# EAGLE schematic schematic (EAGLE 8.3.1)
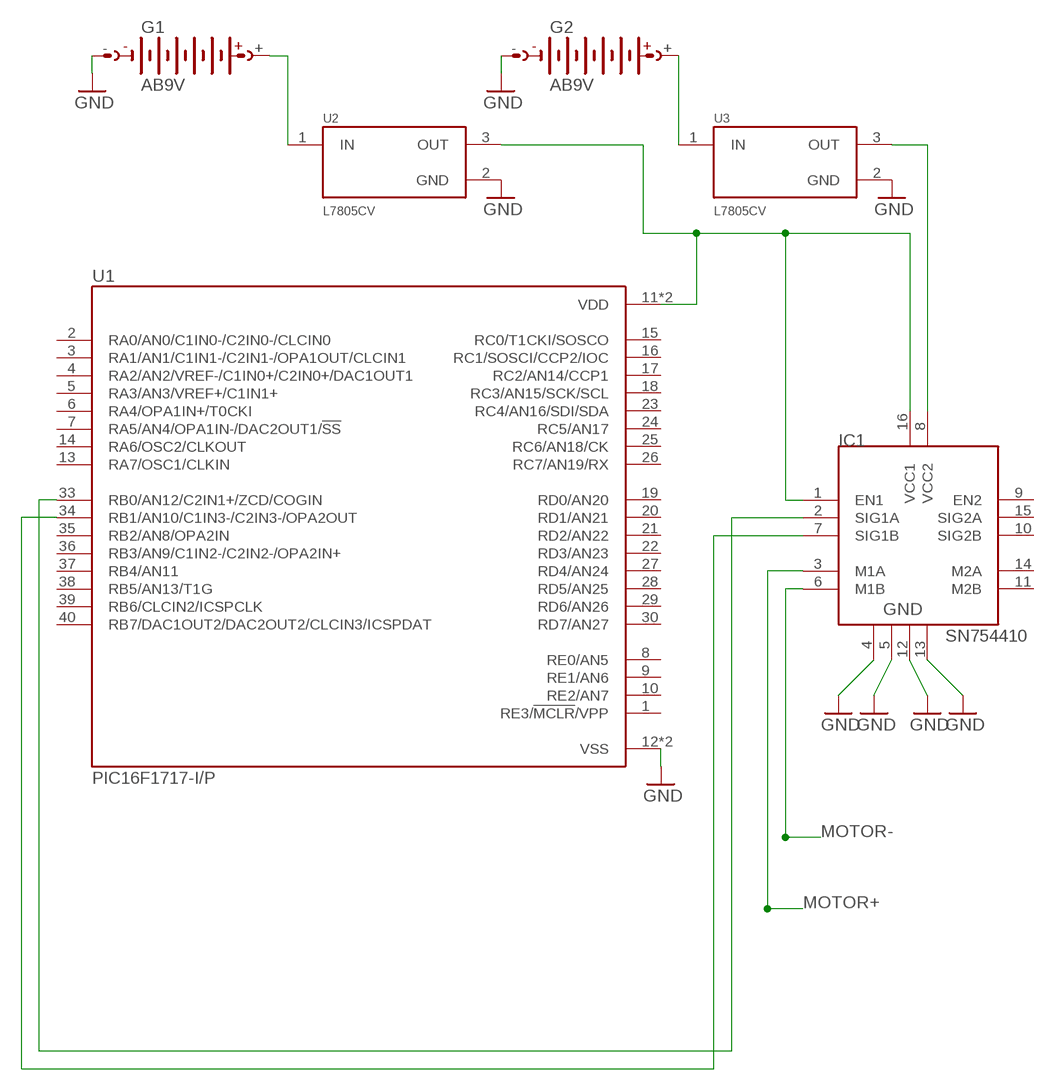
[diagram p0: schematic, sheet 1]

## Parts
G1  AB9V  [AB9V]
G2  AB9V  [AB9V]
IC1  SN754410  [DIP16]
U1  PIC16F1717-I/P  [DIP1543W47P254L5321H635Q40]
U2  L7805CV  [TO254P460X1020X1945-3P]
U3  L7805CV  [TO254P460X1020X1945-3P]

## Nets
GND: G1.- G2.- IC1.4 IC1.5 IC1.12 IC1.13 U1.12(VSS) U1.31(VSS) U2.2(GND) U3.2(GND)
MOTOR+: IC1.3(M1A)
MOTOR-: IC1.6(M1B)
N$1: IC1.2(SIG1A) U1.33(RB0/AN12/C2IN1+/ZCD/COGIN)
N$2: IC1.7(SIG1B) U1.34(RB1/AN10/C1IN3-/C2IN3-/OPA2OUT)
N$3: G1.+ U2.1(IN)
N$4: G2.+ U3.1(IN)
N$5: IC1.8(VCC2) U3.3(OUT)
N$6: IC1.1(EN1) IC1.16(VCC1) U1.11(VDD) U1.32(VDD) U2.3(OUT)
Unconnected: IC1.9(EN2) IC1.10(SIG2B) IC1.11(M2B) IC1.14(M2A) IC1.15(SIG2A) U1.1(RE3/!MCLR!/VPP) U1.2(RA0/AN0/C1IN0-/C2IN0-/CLCIN0) U1.3(RA1/AN1/C1IN1-/C2IN1-/OPA1OUT/CLCIN1) U1.4(RA2/AN2/VREF-/C1IN0+/C2IN0+/DAC1OUT1) U1.5(RA3/AN3/VREF+/C1IN1+) U1.6(RA4/OPA1IN+/T0CKI) U1.7(RA5/AN4/OPA1IN-/DAC2OUT1/!SS) U1.8(RE0/AN5) U1.9(RE1/AN6) U1.10(RE2/AN7) U1.13(RA7/OSC1/CLKIN) U1.14(RA6/OSC2/CLKOUT) U1.15(RC0/T1CKI/SOSCO) U1.16(RC1/SOSCI/CCP2/IOC) U1.17(RC2/AN14/CCP1) U1.18(RC3/AN15/SCK/SCL) U1.19(RD0/AN20) U1.20(RD1/AN21) U1.21(RD2/AN22) U1.22(RD3/AN23) U1.23(RC4/AN16/SDI/SDA) U1.24(RC5/AN17) U1.25(RC6/AN18/CK) U1.26(RC7/AN19/RX) U1.27(RD4/AN24) U1.28(RD5/AN25) U1.29(RD6/AN26) U1.30(RD7/AN27) U1.35(RB2/AN8/OPA2IN) U1.36(RB3/AN9/C1IN2-/C2IN2-/OPA2IN+) U1.37(RB4/AN11) U1.38(RB5/AN13/T1G) U1.39(RB6/CLCIN2/ICSPCLK) U1.40(RB7/DAC1OUT2/DAC2OUT2/CLCIN3/ICSPDAT)

## Library data of the parts
G1 G2 = battery:AB9V: 9-V BATTERY CLIP
IC1 = HBridge:SN754410: Quadruple half-H driver
U1 = PIC16F1717-I_P:PIC16F1717-I/P: MCU 8-bit PIC16 PIC RISC 14KB Flash 3.3V/5V Automotive 40-Pin PDIP Tube; AVAILABILITY: Unavailable; DESCRIPTION: MCU 8-bit PIC16 PIC RISC 14KB Flash 3.3V/5V Automotive 40-Pin PDIP Tube; MF: Microchip; MP: PIC16F1717-I/P; PACKAGE: PDIP-40 Microchip; PRICE: None
U2 U3 = L7805CV:L7805CV: L7805 Series 1.5 A 5 V Three Terminal Voltage Regulator - TO-220; AVAILABILITY: Unavailable; DESCRIPTION: Standard Regulator Pos 5V 1.5A 3-Pin_3+Tab_ TO-220 Standard Regulator Pos 5V 1.5A 3-Pin_3+Tab_ TO-220; MF: STMicroelectronics; MP: L7805CV; PACKAGE: TO-220 STMicroelectronics; PRICE: None